# Altium schematic sheet tubes.SchDoc
size A; SheetNumber: 4; SheetTotal: 8
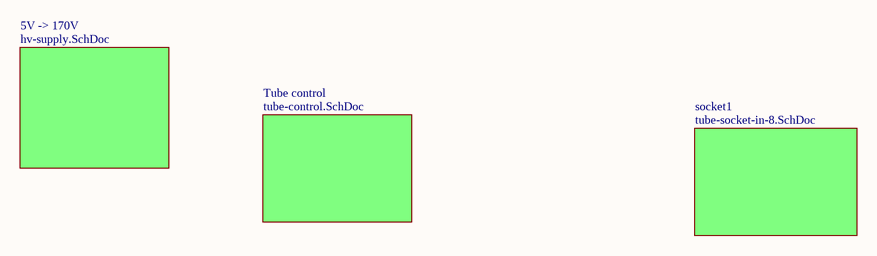
[diagram p0: tubes.SchDoc]

## Sub-sheets
5V -> 170V = hv-supply.SchDoc: no entries
socket1 = tube-socket-in-8.SchDoc: no entries
Tube control = tube-control.SchDoc: no entries